# EAGLE design sysXdmd (EAGLE 7.4.0)
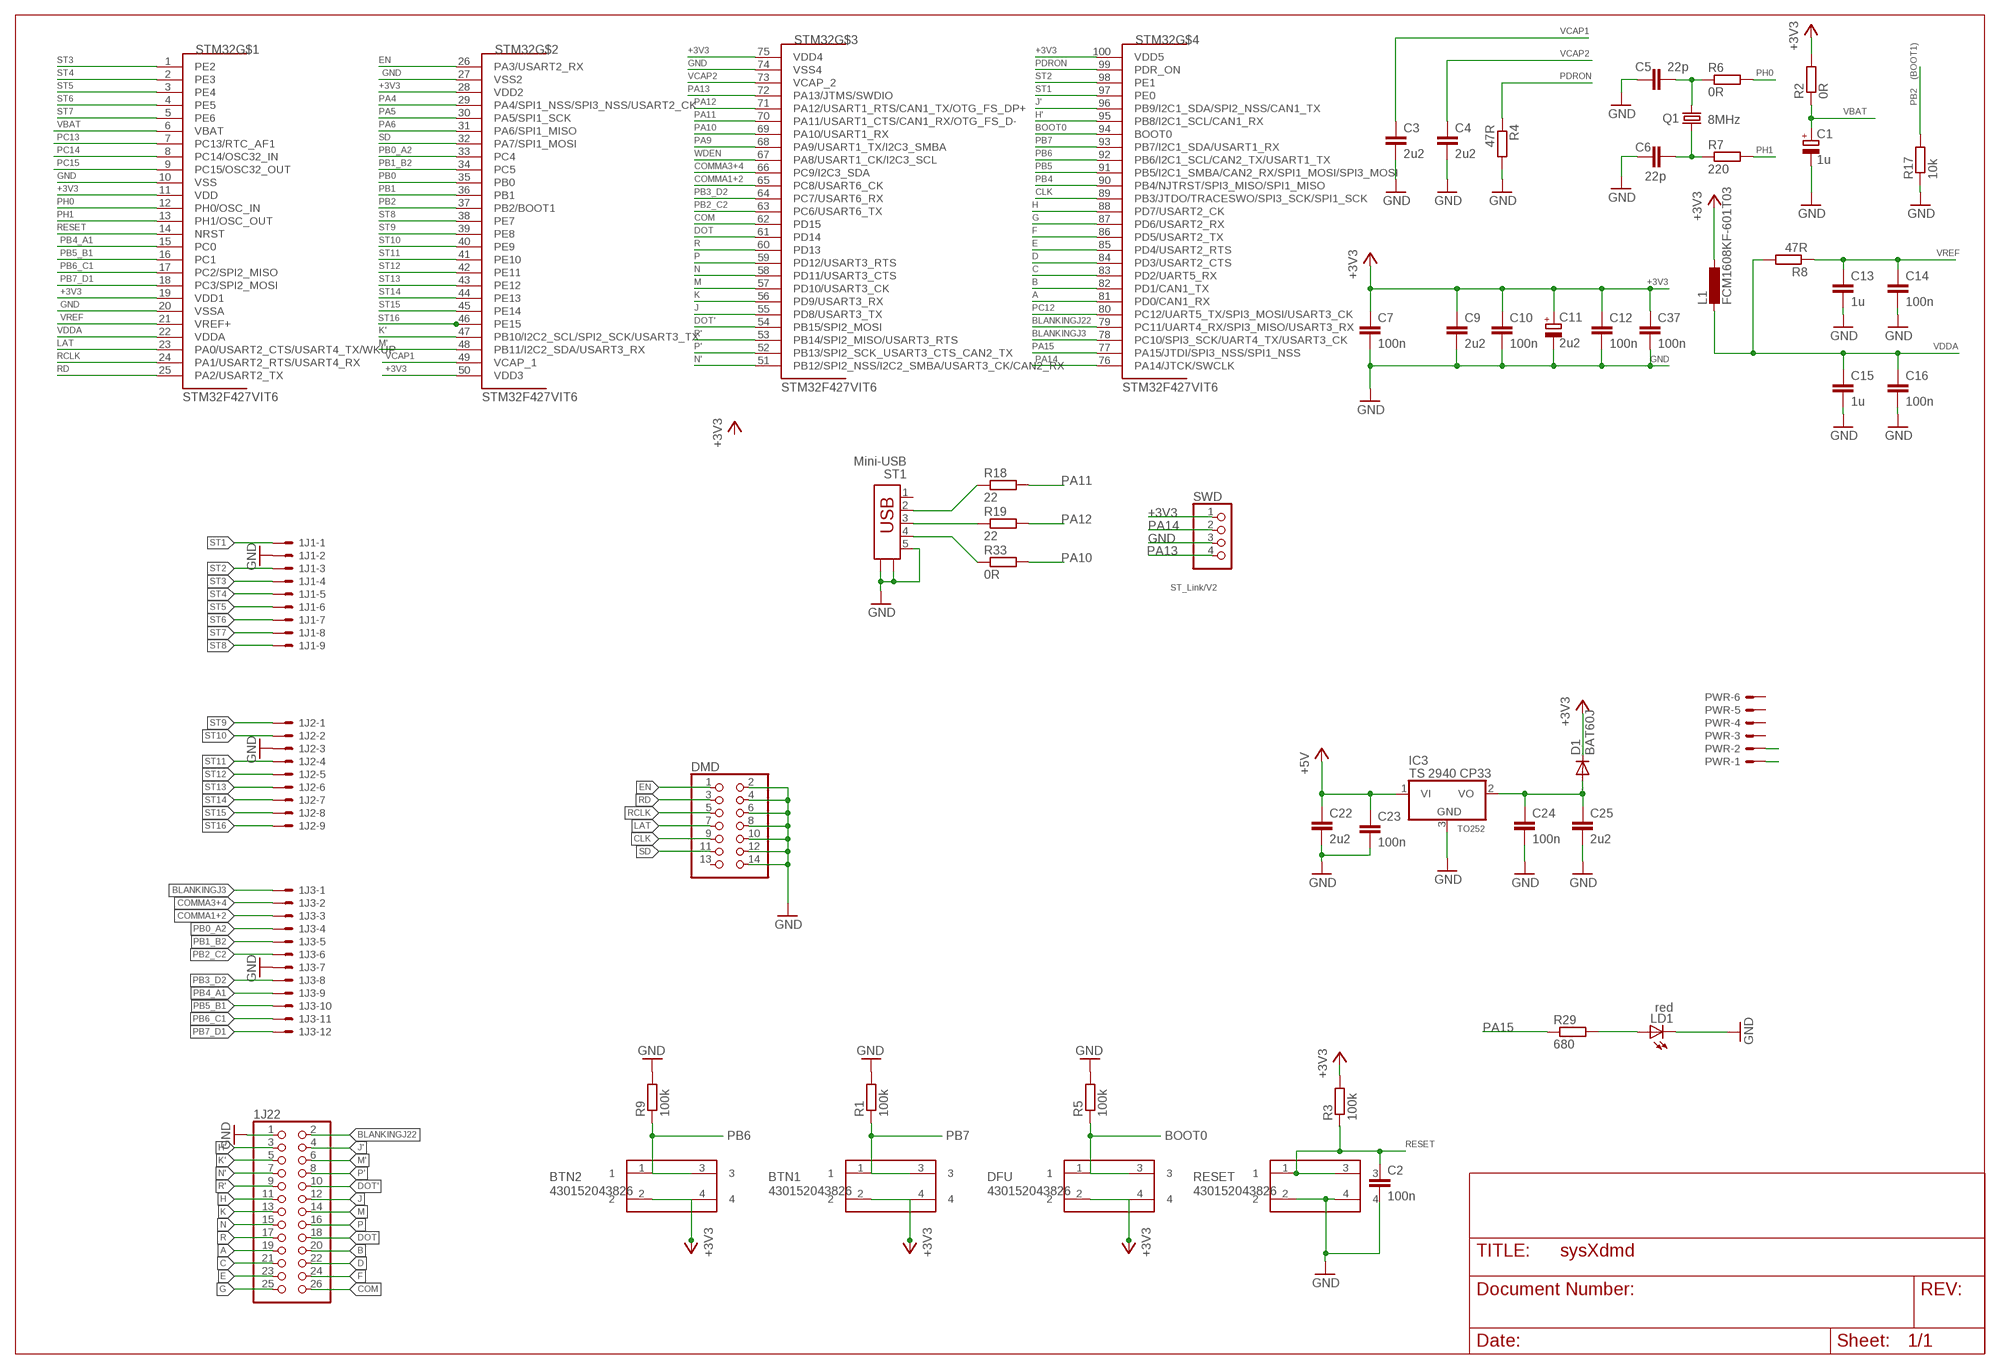
[diagram p0: schematic, sheet 1]

## Parts
1J1  KK-156-9  [KK-156-9]
1J2  KK-156-9  [KK-156-9]
1J3  KK-156-12  [KK-156-12]
1J22  PINHD-2X13  [2X13]
BTN1  430152043826  [430152043826]
BTN2  430152043826  [430152043826]
C1  1u  CPOL-EUCT3528  [CT3528]
C2  100n  C-EUC0805  [C0805]
C3  2u2  C-EUC0805  [C0805]
C4  2u2  C-EUC0805  [C0805]
C5  22p  C-EUC0805  [C0805]
C6  22p  C-EUC0805  [C0805]
C7  100n  C-EUC0805  [C0805]
C9  2u2  C-EUC1206  [C1206]
C10  100n  C-EUC0805  [C0805]
C11  2u2  CPOL-EUCT3528  [CT3528]
C12  100n  C-EUC0805  [C0805]
C13  1u  C-EUC1206  [C1206]
C14  100n  C-EUC0805  [C0805]
C15  1u  C-EUC1206  [C1206]
C16  100n  C-EUC0805  [C0805]
C22  2u2  C-EUC1206  [C1206]
C23  100n  C-EUC0805  [C0805]
C24  100n  C-EUC0805  [C0805]
C25  2u2  C-EUC1206  [C1206]
C37  100n  C-EUC0805  [C0805]
D1  BAT60J  DIODE-SOD323-W  [SOD323-W]
DFU  430152043826  [430152043826]
DMD  PINHD-2X7  [2X07]
IC3  TS 2940 CP33  7808DT  [TO252]
L1  FCM1608KF-601T03  L-EUL0603  [L0603]
LD1  red  LEDCHIP-LED0805  [CHIP-LED0805]
PWR  KK-156-6  [KK-156-6]
Q1  8MHz  CRYSTALHC49UP  [HC49UP]
R1  100k  R-EU_R0805  [R0805]
R2  0R  R-EU_R0805  [R0805]
R3  100k  R-EU_R0805  [R0805]
R4  47R  R-EU_R0805  [R0805]
R5  100k  R-EU_R0805  [R0805]
R6  0R  R-EU_R0805  [R0805]
R7  220  R-EU_R0805  [R0805]
R8  47R  R-EU_R0805  [R0805]
R9  100k  R-EU_R0805  [R0805]
R17  10k  R-EU_R0805  [R0805]
R18  22  R-EU_R0805  [R0805]
R19  22  R-EU_R0805  [R0805]
R29  680  R-EU_R0805  [R0805]
R33  0R  R-EU_R0805  [R0805]
RESET  430152043826  [430152043826]
ST1  Mini-USB  UBS-MINI  [USBMINI]
STM32  STM32F427VIT6  STM32F407VX  [LQFP100]
SWD  PINHD-1X4  [1X04]

## Nets
+3V3: BTN1.2 BTN1.4 BTN2.2 BTN2.4 C7.1 C9.1 C10.1 C11.+ C12.1 C37.1 D1.C DFU.2 DFU.4 L1.1 R2.2 R3.2 STM32.11(VDD) STM32.19(VDD1) STM32.28(VDD2) STM32.50(VDD3) STM32.75(VDD4) STM32.100(VDD5) SWD.1
+5V: C22.1 C23.1 IC3.1(VI) PWR.1
A: 1J22.19 STM32.81(PD0/CAN1_RX)
B: 1J22.20 STM32.82(PD1/CAN1_TX)
BLANKINGJ3: 1J3.1 STM32.78(PC10/SPI3_SCK/UART4_TX/USART3_CK)
BLANKINGJ22: 1J22.2 STM32.79(PC11/UART4_RX/SPI3_MISO/USART3_RX)
BOOT0: DFU.1 DFU.3 R5.1 STM32.94(BOOT0)
C: 1J22.21 STM32.83(PD2/UART5_RX)
CLK: DMD.9 STM32.89(PB3/JTDO/TRACESWO/SPI3_SCK/SPI1_SCK)
COM: 1J22.26 STM32.62(PD15)
COMMA1+2: 1J3.3 STM32.65(PC8/USART6_CK)
COMMA3+4: 1J3.2 STM32.66(PC9/I2C3_SDA)
D: 1J22.22 STM32.84(PD3/USART2_CTS)
DOT: 1J22.18 STM32.61(PD14)
DOT': 1J22.10 STM32.54(PB15/SPI2_MOSI)
E: 1J22.23 STM32.85(PD4/USART2_RTS)
EN: DMD.1 STM32.26(PA3/USART2_RX)
F: 1J22.24 STM32.86(PD5/USART2_TX)
G: 1J22.25 STM32.87(PD6/USART2_RX)
GND: 1J1.2 1J2.3 1J3.7 1J22.1 C1.- C2.2 C3.2 C4.2 C5.2 C6.2 C7.2 C9.2 C10.2 C11.- C12.2 C13.2 C14.2 C15.2 C16.2 C22.2 C23.2 C24.2 C25.2 C37.2 DMD.2 DMD.4 DMD.6 DMD.8 DMD.10 DMD.12 DMD.14 IC3.3(GND) LD1.C PWR.2 R1.2 R4.2 R5.2 R9.2 R17.1 RESET.2 RESET.4 ST1.5 ST1.N1 ST1.N2 STM32.10(VSS) STM32.20(VSSA) STM32.27(VSS2) STM32.74(VSS4) SWD.3
H: 1J22.11 STM32.88(PD7/USART2_CK)
H': 1J22.3 STM32.95(PB8/I2C1_SCL/CAN1_RX)
J: 1J22.12 STM32.55(PD8/USART3_TX)
J': 1J22.4 STM32.96(PB9/I2C1_SDA/SPI2_NSS/CAN1_TX)
K: 1J22.13 STM32.56(PD9/USART3_RX)
K': 1J22.5 STM32.47(PB10/I2C2_SCL/SPI2_SCK/USART3_TX)
LAT: DMD.7 STM32.23(PA0/USART2_CTS/USART4_TX/WKUP)
M: 1J22.14 STM32.57(PD10/USART3_CK)
M': 1J22.6 STM32.48(PB11/I2C2_SDA/USART3_RX)
N: 1J22.15 STM32.58(PD11/USART3_CTS)
N$1: C5.1 Q1.2 R6.1
N$2: C6.1 Q1.1 R7.1
N$12: C24.1 C25.1 D1.A IC3.2(VO)
N$19: LD1.A R29.2
N$25: R33.1 ST1.4
N$39: R19.1 ST1.3
N$40: R18.1 ST1.2
N': 1J22.7 STM32.51(PB12/SPI2_NSS/I2C2_SMBA/USART3_CK/CAN2_RX)
P: 1J22.16 STM32.59(PD12/USART3_RTS)
P': 1J22.8 STM32.52(PB13/SPI2_SCK_USART3_CTS_CAN2_TX)
PA4: STM32.29(PA4/SPI1_NSS/SPI3_NSS/USART2_CK)
PA5: STM32.30(PA5/SPI1_SCK)
PA6: STM32.31(PA6/SPI1_MISO)
PA9: STM32.68(PA9/USART1_TX/I2C3_SMBA)
PA10: R33.2 STM32.69(PA10/USART1_RX)
PA11: R18.2 STM32.70(PA11/USART1_CTS/CAN1_RX/OTG_FS_D-)
PA12: R19.2 STM32.71(PA12/USART1_RTS/CAN1_TX/OTG_FS_DP+)
PA13: STM32.72(PA13/JTMS/SWDIO) SWD.4
PA14: STM32.76(PA14/JTCK/SWCLK) SWD.2
PA15: R29.1 STM32.77(PA15/JTDI/SPI3_NSS/SPI1_NSS)
PB0: STM32.35(PB0)
PB0_A2: 1J3.4 STM32.33(PC4)
PB1: STM32.36(PB1)
PB1_B2: 1J3.5 STM32.34(PC5)
PB2: R17.2 STM32.37(PB2/BOOT1)
PB2_C2: 1J3.6 STM32.63(PC6/USART6_TX)
PB3_D2: 1J3.8 STM32.64(PC7/USART6_RX)
PB4: STM32.90(PB4/NJTRST/SPI3_MISO/SPI1_MISO)
PB4_A1: 1J3.9 STM32.15(PC0)
PB5: STM32.91(PB5/I2C1_SMBA/CAN2_RX/SPI1_MOSI/SPI3_MOSI)
PB5_B1: 1J3.10 STM32.16(PC1)
PB6: BTN2.1 BTN2.3 R9.1 STM32.92(PB6/I2C1_SCL/CAN2_TX/USART1_TX)
PB6_C1: 1J3.11 STM32.17(PC2/SPI2_MISO)
PB7: BTN1.1 BTN1.3 R1.1 STM32.93(PB7/I2C1_SDA/USART1_RX)
PB7_D1: 1J3.12 STM32.18(PC3/SPI2_MOSI)
PC12: STM32.80(PC12/UART5_TX/SPI3_MOSI/USART3_CK)
PC13: STM32.7(PC13/RTC_AF1)
PC14: STM32.8(PC14/OSC32_IN)
PC15: STM32.9(PC15/OSC32_OUT)
PDRON: R4.1 STM32.99(PDR_ON)
PH0: R6.2 STM32.12(PH0/OSC_IN)
PH1: R7.2 STM32.13(PH1/OSC_OUT)
R: 1J22.17 STM32.60(PD13)
R': 1J22.9 STM32.53(PB14/SPI2_MISO/USART3_RTS)
RCLK: DMD.5 STM32.24(PA1/USART2_RTS/USART4_RX)
RD: DMD.3 STM32.25(PA2/USART2_TX)
RESET: C2.1 R3.1 RESET.1 RESET.3 STM32.14(NRST)
SD: DMD.11 STM32.32(PA7/SPI1_MOSI)
ST1: 1J1.1 STM32.97(PE0)
ST2: 1J1.3 STM32.98(PE1)
ST3: 1J1.4 STM32.1(PE2)
ST4: 1J1.5 STM32.2(PE3)
ST5: 1J1.6 STM32.3(PE4)
ST6: 1J1.7 STM32.4(PE5)
ST7: 1J1.8 STM32.5(PE6)
ST8: 1J1.9 STM32.38(PE7)
ST9: 1J2.1 STM32.39(PE8)
ST10: 1J2.2 STM32.40(PE9)
ST11: 1J2.4 STM32.41(PE10)
ST12: 1J2.5 STM32.42(PE11)
ST13: 1J2.6 STM32.43(PE12)
ST14: 1J2.7 STM32.44(PE13)
ST15: 1J2.8 STM32.45(PE14)
ST16: 1J2.9 STM32.46(PE15)
VBAT: C1.+ R2.1 STM32.6(VBAT)
VCAP1: C3.1 STM32.49(VCAP_1)
VCAP2: C4.1 STM32.73(VCAP_2)
VDDA: C15.1 C16.1 L1.2 R8.2 STM32.22(VDDA)
VREF: C13.1 C14.1 R8.1 STM32.21(VREF+)
WDEN: STM32.67(PA8/USART1_CK/I2C3_SCL)
Unconnected: DMD.13 PWR.3 PWR.4 PWR.5 PWR.6 ST1.1

## Notes on the sheet
- (BOOT1)
- ST_Link/V2
- TO252

## Library data of the parts
1J1 1J2 = con-molex:KK-156-9: KK 156 HEADER Source: http://www.molex.com/pdm_docs/sd/026604100_sd.pdf; OC_FARNELL: unknown; OC_NEWARK: unknown
1J3 = con-molex:KK-156-12: KK 156 HEADER Source: http://www.molex.com/pdm_docs/sd/026604100_sd.pdf; OC_FARNELL: unknown; OC_NEWARK: unknown
1J22 = pinhead:PINHD-2X13: PIN HEADER
BTN1 BTN2 DFU RESET = Switches_rev16a:430152043826: WS-TSS-6x6 mm SMD Tact Switch,4 pins
C1 C11 = rcl:CPOL-EU: POLARIZED CAPACITOR, European symbol
C2 C5-C7 C10 C12 C16 C23 C24 C37 = rcl:C-EU: CAPACITOR, European symbol
C3 C4 C9 C13-C15 C22 C25 = resistor:C-EU: CAPACITOR, European symbol
D1 = diode:DIODE-: DIODE
DMD = pinhead:PINHD-2X7: PIN HEADER
IC3 = linear:78*: Positive VOLTAGE REGULATOR Source: http://cache.national.com/ds/LM/LM78L05.pdf http://www.fairchildsemi.com/ds/LM/LM7805.pdf
L1 = rcl:L-EU: INDUCTOR, European symbol
LD1 = adafruit:LED: LED OSRAM: - CHIPLED LG R971, LG N971, LY N971, LG Q971, LY Q971, LO R971, LY R971 LH N974, LH R974 LS Q976, LO Q976, LY Q976 LO Q996 - Hyper CHIPLED LW Q18S LB Q993, LB Q99A, LB R99A - SideLED LS A670, LO A670, LY A670, LG A670, LP A670 LB A673, LV A673, LT A673, LW A673 LH A674 LY A675 LS A676, LA A676, LO A676, LY A676, LW A676 LS A679, LY A679, LG A679 - Hyper Micro SIDELED® LS Y876, LA Y876, LO Y876, LY Y876 LT Y87S - SmartLED LW L88C, LW L88S LB L89C, LB L89S, LG L890 LS L89K, LO L89K, LY L89K LS L896, LA L896, LO L896, LY L896 - TOPLED LS T670, LO T670, LY T670, LG T670, LP T670 LSG T670, LSP T670, LSY T670, LOP T670, LYG T670 LG T671, LOG T671, LSG T671 LB T673, LV T673, LT T673, LW T673 LH T674 LS T676, LA T676, LO T676, LY T676, LB T676, LH T676, LSB T676, LW T676 LB T67C, LV T67C, LT T67C, LS T67K, LO T67K, LY T67K, LW E67C LS E67B, LA E67B, LO E67B, LY E67B, LB E67C, LV E67C, LT E67C LW T67C LS T679, LY T679, LG T679 LS T770, LO T770, LY T770, LG T770, LP T770 LB T773, LV T773, LT T773, LW T773 LH T774 LS E675, LA E675, LY E675, LS T675 LS T776, LA T776, LO T776, LY T776, LB T776 LHGB T686 LT T68C, LB T68C - Hyper Mini TOPLED® LB M676 - Mini TOPLED Santana® LG M470 LS M47K, LO M47K, LY M47K Source: http://www.osram.convergy.de/
PWR = con-molex:KK-156-6: KK 156 HEADER Source: http://www.molex.com/pdm_docs/sd/026604100_sd.pdf; OC_FARNELL: unknown; OC_NEWARK: unknown
Q1 = crystal:CRYSTAL: CRYSTAL; OC_FARNELL: unknown; OC_NEWARK: unknown
R1 R3 R5 R9 R18 R19 R29 R33 = resistor:R-EU_: RESISTOR, European symbol
R2 R4 R6-R8 R17 = rcl:R-EU_: RESISTOR, European symbol
ST1 = con-amp:UBS-MINI
STM32 = STM32F407Vx_LQFP100:STM32F407VX: STmicroelectronics Cortex M4 Series Typ: STM32F407Vx LQFP100 Copyright 2012 by Ersan Günes, Quantitec, info@quantitec.de
SWD = pinhead:PINHD-1X4: PIN HEADER

## Board
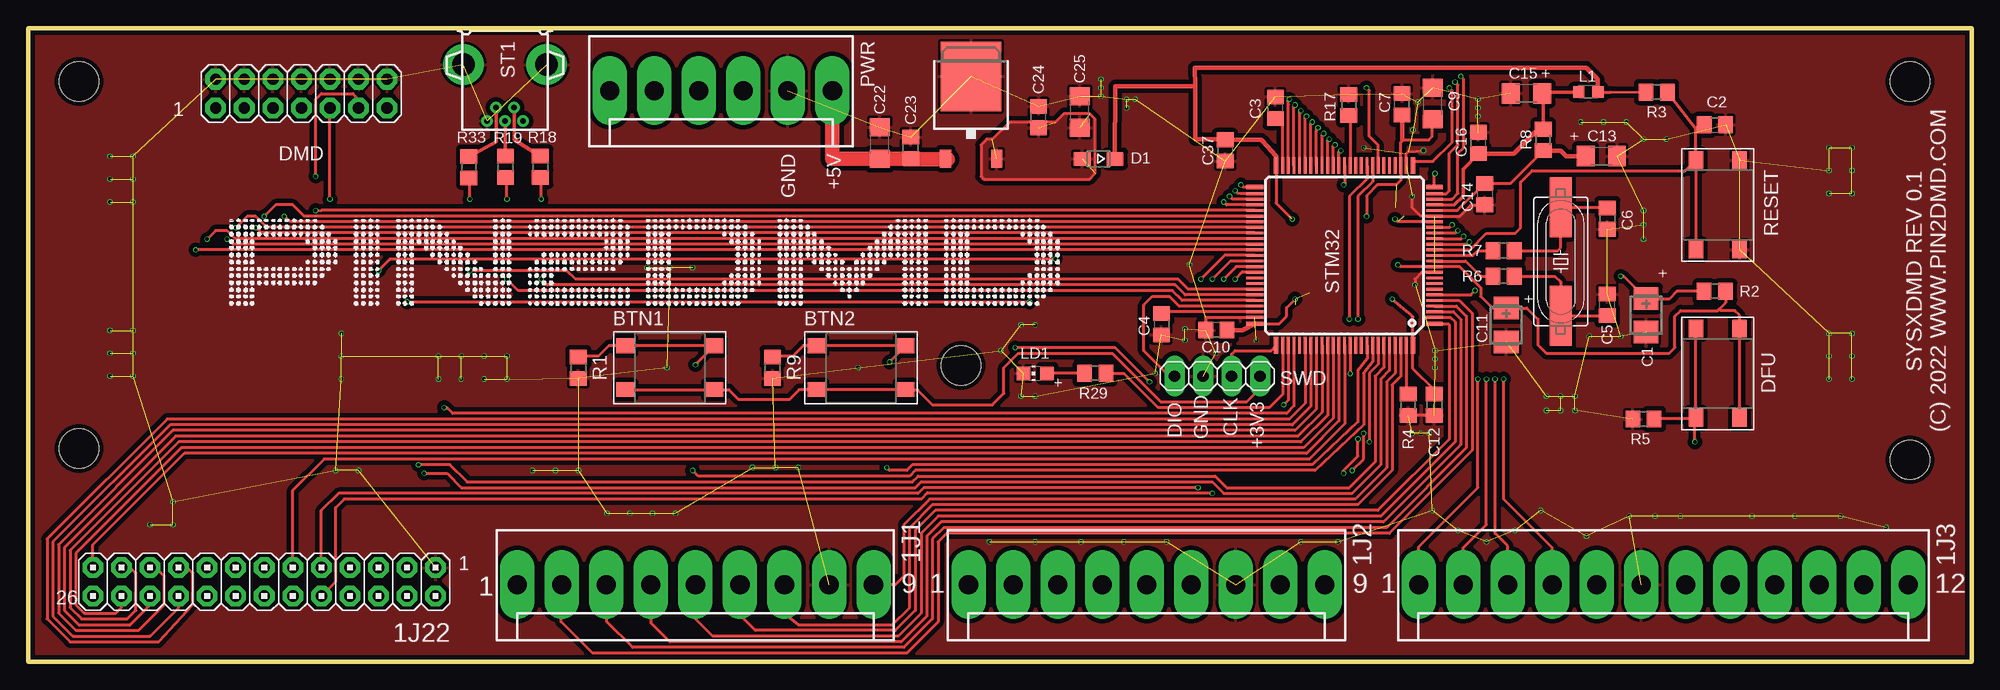
[diagram p1: board, top side]
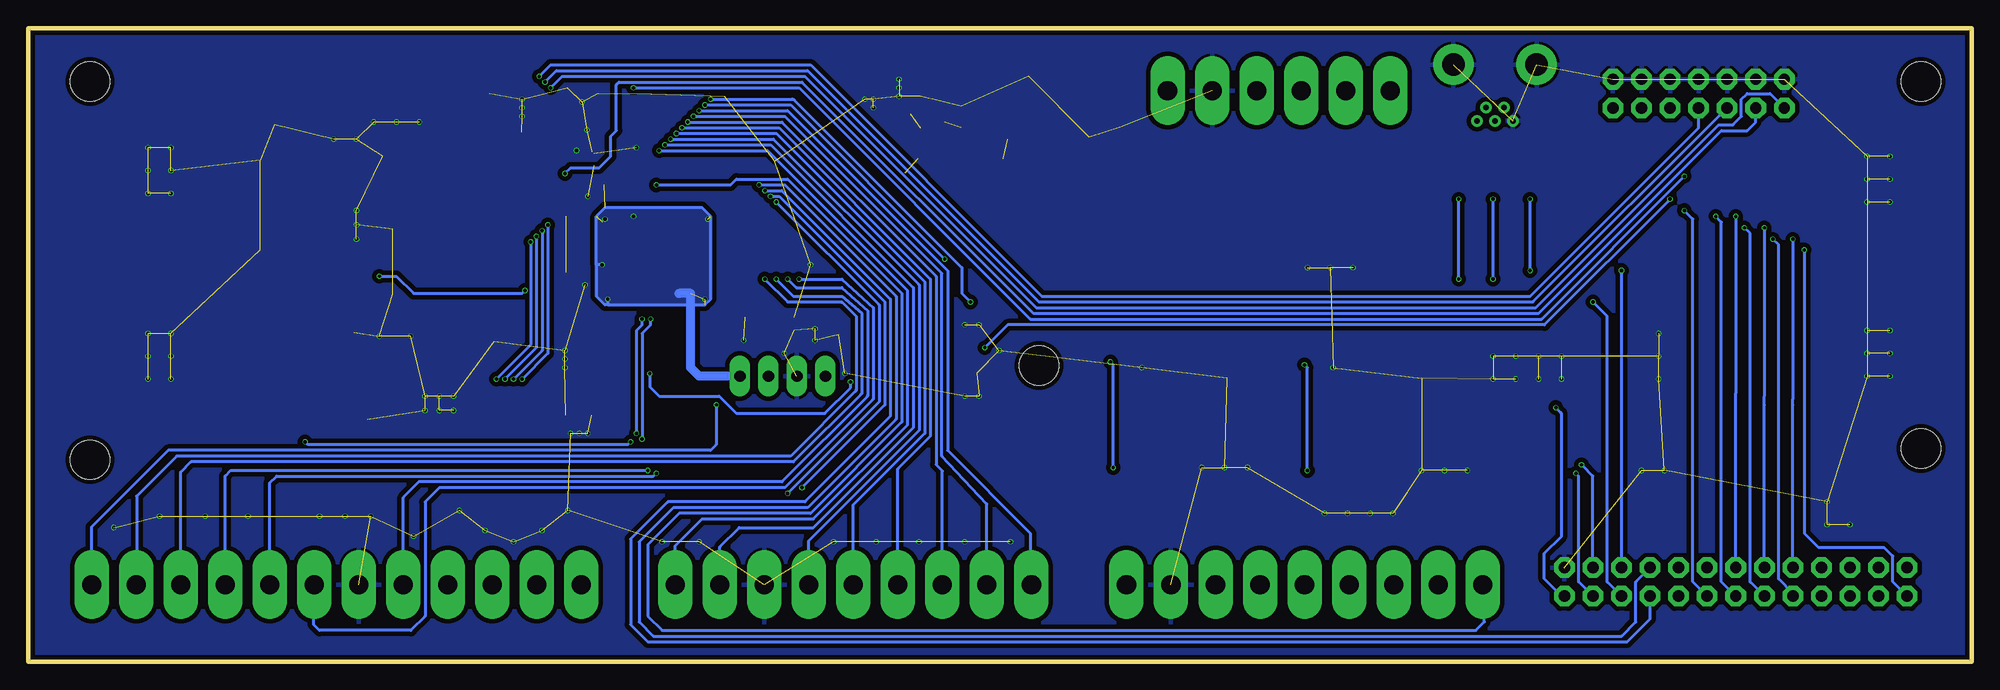
[diagram p2: board, bottom side, seen from below]

Size 172.9 x 56.36 mm. Coordinates in mm from the lower left corner, seen from the top.
Outline: 0,0 0,56.36 172.9,56.36 172.9,0 0,0
Copper layers (1*16): Top 0.035mm / dielectric 1.6mm / Bottom 0.035mm
Design rules "Elecrow_2-layer_PCB_eagle_rule *": minimum track width 5mil, minimum drill 0.3mm, track to track 5mil, track to pad 5mil, pad to pad 5mil, via to via 5mil, smd to smd 0mil, copper to edge 0.2mm, drill to drill 6mil, minimum pad ring 10mil, minimum via ring 3mil, stop-mask expansion 4mil, vias tented up to drill 0mil, thermal gap 10mil
Holes 3.5 mm at 4.51,18.99 167.41,17.97 167.41,51.6 4.51,51.6 82.99,26.35

### Footprints (pad centres in the part's own frame; a part is rotated, then mirrored left to right if it is on the bottom)
KK-156-9 = drill 1.7 pad 2.184 long: 1 -15.84,0; 2 -11.88,0; 3 -7.92,0; 4 -3.96,0; 5 0,0; 6 3.96,0; 7 7.92,0; 8 11.88,0; 9 15.84,0
KK-156-12 = drill 1.7 pad 2.184 long: 1 -21.78,0; 2 -17.82,0; 3 -13.86,0; 4 -9.9,0; 5 -5.94,0; 6 -1.98,0; 7 1.98,0; 8 5.94,0; 9 9.9,0; 10 13.86,0; 11 17.82,0; 12 21.78,0
2X13 = drill 1.016 octagon: 1 -15.24,-1.27; 2 -15.24,1.27; 3 -12.7,-1.27; 4 -12.7,1.27; 5 -10.16,-1.27; 6 -10.16,1.27; 7 -7.62,-1.27; 8 -7.62,1.27; 9 -5.08,-1.27; 10 -5.08,1.27; 11 -2.54,-1.27; 12 -2.54,1.27; 13 0,-1.27; 14 0,1.27; 15 2.54,-1.27; 16 2.54,1.27; 17 5.08,-1.27; 18 5.08,1.27; 19 7.62,-1.27; 20 7.62,1.27; 21 10.16,-1.27; 22 10.16,1.27; 23 12.7,-1.27; 24 12.7,1.27; 25 15.24,-1.27; 26 15.24,1.27
430152043826 = smd 1.55 x 1.3: 1 -3.975,1.95; 2 -3.975,-1.95; 3 3.975,1.95; 4 3.975,-1.95
CT3528 = smd 2 x 2.2: + -1.5,0; - 1.5,0
C0805 = smd 1.3 x 1.5: 1 -0.95,0; 2 0.95,0
C1206 = smd 1.6 x 1.8: 1 -1.4,0; 2 1.4,0
SOD323-W = smd 1.5 x 1.2: A 1.45,0; C -1.45,0
2X07 = drill 1.016 octagon: 1 -7.62,-1.27; 2 -7.62,1.27; 3 -5.08,-1.27; 4 -5.08,1.27; 5 -2.54,-1.27; 6 -2.54,1.27; 7 0,-1.27; 8 0,1.27; 9 2.54,-1.27; 10 2.54,1.27; 11 5.08,-1.27; 12 5.08,1.27; 13 7.62,-1.27; 14 7.62,1.27
TO252 = smd 1 x 1.6: 1 -2.28,-4.8; 2 2.28,-4.8 | smd 5.4 x 6.2: 3 0,2.5
L0603 = smd 1 x 1: 1 -0.85,0; 2 0.85,0
CHIP-LED0805 = smd 1.2 x 1.2: A 0,-1.05; C 0,1.05
KK-156-6 = drill 1.7 pad 2.184 long: 1 -9.9,0; 2 -5.94,0; 3 -1.98,0; 4 1.98,0; 5 5.94,0; 6 9.9,0
HC49UP = smd 5.334 x 1.93: 1 -4.826,0; 2 4.826,0
R0805 = smd 1.3 x 1.5: 1 -0.95,0; 2 0.95,0
USBMINI = drill 0.5: 1 -1.6,3; 2 -0.8,1.8; 3 0,3; 4 0.8,1.8; 5 1.6,3 | drill 2: N1 -3.7,-2; N2 3.7,-2
LQFP100 = smd 1.5 x 0.4: 1 -8,6.075; 25 -8,-6.075; 51 8,-6.075; 75 8,6.075 | smd 1.5 x 0.25: 2 -8,5.5; 3 -8,5; 4 -8,4.5; 5 -8,4; 6 -8,3.5; 7 -8,3; 8 -8,2.5; 9 -8,2; 10 -8,1.5; 11 -8,1; 12 -8,0.5; 13 -8,0; 14 -8,-0.5; 15 -8,-1; 16 -8,-1.5; 17 -8,-2; 18 -8,-2.5; 19 -8,-3; 20 -8,-3.5; 21 -8,-4; 22 -8,-4.5; 23 -8,-5; 24 -8,-5.5; 52 8,-5.5; 53 8,-5; 54 8,-4.5; 55 8,-4; 56 8,-3.5; 57 8,-3; 58 8,-2.5; 59 8,-2; 60 8,-1.5; 61 8,-1; 62 8,-0.5; 63 8,0; 64 8,0.5; 65 8,1; 66 8,1.5; 67 8,2; 68 8,2.5; 69 8,3; 70 8,3.5; 71 8,4; 72 8,4.5; 73 8,5; 74 8,5.5 | smd 0.4 x 1.5: 26 -6.075,-8; 50 6.075,-8; 76 6.075,8; 100 -6.075,8 | smd 0.25 x 1.5: 27 -5.5,-8; 28 -5,-8; 29 -4.5,-8; 30 -4,-8; 31 -3.5,-8; 32 -3,-8; 33 -2.5,-8; 34 -2,-8; 35 -1.5,-8; 36 -1,-8; 37 -0.5,-8; 38 0,-8; 39 0.5,-8; 40 1,-8; 41 1.5,-8; 42 2,-8; 43 2.5,-8; 44 3,-8; 45 3.5,-8; 46 4,-8; 47 4.5,-8; 48 5,-8; 49 5.5,-8; 77 5.5,8; 78 5,8; 79 4.5,8; 80 4,8; 81 3.5,8; 82 3,8; 83 2.5,8; 84 2,8; 85 1.5,8; 86 1,8; 87 0.5,8; 88 0,8; 89 -0.5,8; 90 -1,8; 91 -1.5,8; 92 -2,8; 93 -2.5,8; 94 -3,8; 95 -3.5,8; 96 -4,8; 97 -4.5,8; 98 -5,8; 99 -5.5,8
1X04 = drill 1.016 long: 1 -3.81,0; 2 -1.27,0; 3 1.27,0; 4 3.81,0

### Placement (x,y rotation side)
1J1  59.36,6.86 180 top
1J2  99.49,6.86 180 top
1J3  145.47,6.86 180 top
1J22  21.01,7.11 180 top
BTN1  57.07,26.16 0 top
BTN2  74.09,26.16 0 top
C1  143.91,30.82 270 top
C2  150.04,47.75 0 top
C3  110.95,49.29 90 top
C4  100.81,30.02 270 top
C5  140.46,31.75 90 top
C6  140.48,39.42 270 top
C7  122.21,49.58 90 top
C9  124.95,49.64 90 top
C10  105.7,29.51 180 top
C11  131.49,29.96 270 top
C12  125.07,22.86 270 top
C13  139.93,44.98 0 top
C14  129.56,41.61 270 top
C15  133.28,50.56 180 top
C16  129.01,46.15 90 top
C22  75.76,46.13 90 top
C23  78.51,45.71 90 top
C24  89.88,48.45 90 top
C25  93.54,48.89 90 top
C37  106.47,45.48 270 top
D1  95.22,44.74 180 top
DFU  150.29,25.65 90 top
DMD  24.31,50.55 0 top
IC3  83.88,49.56 0 top
L1  138.79,50.67 180 top
LD1  89.59,25.65 90 top
PWR  61.65,50.8 180 top
Q1  136.32,35.61 270 top
R1  48.95,26.16 270 top
R2  150.04,32.95 0 top
R3  144.86,50.67 180 top
R4  122.76,22.86 270 top
R5  143.69,21.59 180 top
R6  131.24,34.29 180 top
R7  131.24,36.58 180 top
R8  134.77,46.42 90 top
R9  66.22,26.16 270 top
R17  117.47,49.52 270 top
R18  45.57,44.03 270 top
R19  42.46,44.03 270 top
R29  94.92,25.65 180 top
R33  39.2,43.99 270 top
RESET  150.29,40.64 90 top
ST1  42.42,51.11 180 top
STM32  117.09,36.14 180 top
SWD  105.78,25.4 180 top

### Tracks (layer width: path | path; a pad name or v marks a point on that pad's centre or on a via)
+3V3  (via drill 0.3)  (5 unrouted)
  Top 0.254: 111.01,44.96 111.07,44.92 STM32.50 111.02,40.8 v112.45,39.37 | 122.25,46.43 122.35,46.43 | 122.35,46.43 124.59,46.43 124.89,46.74 124.89,48.18 C9.1 | C12.1 125.07,24.21 123.17,26.08 STM32.100 123.17,30.68 122.86,30.99 v121.34,32.26 | STM32.19 121.82,39.14 v121.59,39.37 | v119.05,39.62 119.05,41.45 120.02,42.42 121.69,42.42 122.09,42.82 STM32.28 122.09,46.17 122.35,46.43 | STM32.75 111.27,30.06 111.94,30.73 111.94,31.5 v112.7,32.26 | v121.84,35.31 122.01,35.14 STM32.11 127.34,35.14 129.21,33.27 129.21,32.51 130.23,31.5 131.45,31.5 C11.+ 133.31,31.46 134.29,30.48 134.29,28.19 135.05,27.43 145.97,27.43 146.48,27.94 146.48,30.73 146.99,31.24 150.29,31.24 150.42,31.37 | L1.1 140.77,50.67 143.89,50.7 R3.2 | DFU.2 DFU.4 152.24,30.82 151.82,31.24 150.55,31.24 150.42,31.37 | 150.42,31.37 150.99,31.94 R2.2 | BTN1.2 BTN1.4 | BTN1.4 61.31,24.21 61.65,23.88 | BTN1.4 62.33,24.21 63.17,23.37 67.74,23.37 68.59,24.21 BTN2.2 BTN2.4 79.09,24.21 80.44,22.86 85.78,22.86 86.79,23.88 86.79,26.16 88.06,27.43 96.44,27.43 100.76,23.11 108.38,23.11 109.65,24.38 109.65,25.34 SWD.1
  Top 0.305: 122.25,48.59 C7.1
  Top 0.406: C10.1 107.98,29.51 STM32.75 | 111.01,44.96 109.77,46.34 109.67,46.43 C37.1 106.42,46.48 103.81,46.48 103.81,51.18 | 122.25,46.43 122.25,48.59 | D1.C 96.7,51.18 103.81,51.18 | L1.1 139.64,51.8 138.61,52.83 103.76,52.83 103.81,51.18
  Bottom 0.254: 122.35,35.31 122.35,39.62 121.59,40.39 112.95,40.39 112.19,39.62 112.19,32.26 112.7,31.75 121.34,31.75 | 122.35,35.31 122.35,32.51 121.59,31.75 121.34,31.75 | v121.34,32.26 121.34,31.75 | v121.84,35.31 122.35,35.31
  Bottom 0.813: SWD.1 113.21,25.4 113.97,26.16 113.97,32.77 114.99,32.77
  pour Bottom: 112.19,32.26 112.7,31.75 121.59,31.75 122.35,32.51 122.35,39.62 121.59,40.39 112.95,40.39 112.19,39.62
+5V
  Top 1.27: IC3.1 81.79,44.7 78,44.7 C23.1 75.25,44.76 C22.1 71.55,44.73 PWR.1
A
  Top 0.254: STM32.81 113.59,22.99 112.19,21.59 12.37,21.59 1.7,10.92 1.7,3.81 3.73,1.78 11.61,1.78 14.66,5.08 14.66,7.87 14.15,8.38 1J22.19
B
  Top 0.254: STM32.82 114.09,22.73 112.45,21.08 12.62,21.08 2.21,10.67 2.21,4.06 3.99,2.29 10.85,2.29 13.39,4.83 1J22.20
BLANKINGJ3  (via drill 0.3)
  Top 0.254: STM32.78 112.09,23.27 v111.68,22.86
  Bottom 0.254: v111.68,22.86 111.68,19.41 arc45 111.76,19.23 112.19,18.8 160.45,18.8 167.25,12 1J3.1
BLANKINGJ22  (via drill 0.3)
  Top 0.254: STM32.79 112.59,22.75 111.94,22.1 37.77,22.1 37.34,22.53 arc45 37.16,22.61 v37.01,22.61
  Bottom 0.254: 1J22.2 36.5,5.84 38.02,7.37 38.02,9.65 36.5,11.18 36.5,21.99 arc-45 36.57,22.17 v37.01,22.61
BOOT0  (via drill 0.3)
  Top 0.254: DFU.3 DFU.1 148.26,21.6 | STM32.94 120.09,26.44 119.3,25.65 v119.3,19.56 | v148.26,19.56 148.26,21.6 | 148.26,21.6 R5.1
  Bottom 0.254: v119.3,19.56 119.56,19.3 148.01,19.3 v148.26,19.56
C
  Top 0.254: STM32.83 114.59,22.47 112.7,20.57 12.88,20.57 2.72,10.41 2.72,4.32 4.24,2.79 9.83,2.79 12.12,5.08 12.12,7.62 11.35,8.38 1J22.21
CLK  (via drill 0.3)
  Top 0.254: v26.85,41.15 DMD.9 | STM32.89 v117.6,25.63 | v99.75,24.89 96.7,27.94 v87.81,27.94
  Bottom 0.254: v117.6,25.63 117.6,24.46 116.76,23.62 111.43,23.62 109.91,22.1 102.03,22.1 99.75,24.38 v99.75,24.89 | v26.85,41.15 38.02,29.97 85.78,29.97 v87.81,27.94
COM  (via drill 0.3)
  Top 0.254: STM32.62 v14.91,36.64
  Bottom 0.254: 1J22.26 7.04,7.11 7.04,9.4 7.8,10.16 13.64,10.16 14.91,11.43 v14.91,36.64
COMMA1+2  (via drill 0.3)
  Top 0.254: STM32.65 107.46,35.14 v106.35,34.04
  Bottom 0.254: v106.35,34.04 104.83,32.51 100.51,32.51 98.73,30.99 98.73,23.98 arc45 98.8,23.8 104.83,17.78 158.42,17.78 159.33,16.87 1J3.3
COMMA3+4  (via drill 0.3)
  Top 0.254: STM32.66 107.97,34.64 v107.37,34.04
  Bottom 0.254: v107.37,34.04 105.33,32 100.61,32 arc45 100.43,31.93 99.24,30.73 99.24,24.23 arc45 99.31,24.06 105.08,18.29 159.69,18.29 163.25,14.73 163.25,6.9 1J3.2
D
  Top 0.254: STM32.84 115.09,22.21 112.95,20.07 13.13,20.07 3.23,10.16 3.23,4.57 4.5,3.3 9.07,3.3 10.85,5.08 1J22.22
DOT  (via drill 0.3)
  Top 0.254: STM32.61 18.21,37.14 17.76,37.59 v17.7,37.59
  Bottom 0.254: 1J22.18 15.93,6.1 17.2,7.37 17.2,37.08 v17.7,37.59
DOT'  (via drill 0.3)
  Top 0.254: v105.33,14.99 79.93,14.99 79.43,14.48 28.12,14.48 27.36,13.72 27.36,7.11 1J22.10 | STM32.54 108.13,40.64 106.6,40.64 v106.35,40.89
  Bottom 0.254: v106.35,40.89 97.21,31.75 97.21,23.11 v105.33,14.99
E
  Top 0.254: STM32.85 115.59,21.94 113.21,19.56 13.39,19.56 3.73,9.91 3.73,4.83 4.75,3.81 8.81,3.81 9.58,4.57 9.58,7.87 9.07,8.38 1J22.23
EN  (via drill 0.3)
  Top 0.254: STM32.26 123.17,44.5 124.95,44.5 126.67,46.23 126.67,50.8 v126.42,51.05
  Bottom 0.254: v126.42,51.05 125.4,52.07 103.81,52.07 83.24,31.5 38.79,31.5 22.53,47.75 21.26,47.75 20.5,48.51 20.5,50.04 19.99,50.55 17.96,50.55 DMD.1
F
  Top 0.254: STM32.86 116.09,21.68 113.46,19.05 13.64,19.05 4.24,9.65 4.24,5.08 5,4.32 7.8,4.32 8.31,4.83 1J22.24
G
  Top 0.254: STM32.87 116.59,21.42 113.72,18.54 13.89,18.54 5.77,10.41 1J22.25
GND  (via drill 0.3, 0.32)  (165 unrouted)
  Top 0.254: STM32.74 104.75,30.64 C10.2 | C14.2 129.52,40.62 128.3,40.62 127.32,39.64 STM32.20 123.86,39.64 123.11,40.39 v123.11,41.4 | C12.2 R4.2 | v124.13,45.47 122.75,45.35 122.59,45.2 STM32.27 | STM32.10 123.97,34.64 123.37,34.04 v123.37,33.53
  other vias: 125.15,27.69 143.69,37.59 143.69,38.86 143.69,40.13 138.1,48.01 140.13,48.01 142.16,48.01 143.69,46.48 145.72,46.48 141.66,28.96 138.86,28.96 97.71,49.28 97.71,50.04 98.48,50.04 95.43,50.29 95.43,51.05 95.43,51.82 123.11,20.32 123.88,20.32 124.64,20.32 125.15,26.92 125.15,26.16 123.62,49.78 123.19,47.29 128.96,48.51 128.96,49.28 128.96,50.04 12.88,14.22 10.85,12.19 12.88,12.19 27.36,17.02 29.39,17.02 27.86,25.15 27.86,27.18 27.86,29.21 36.5,27.18 38.53,27.18 40.56,27.18 42.6,27.18 51.49,13.21 53.52,13.21 55.55,13.21 57.58,13.21 7.29,40.89 7.29,42.93 7.29,44.96 9.32,44.96 9.32,42.93 9.32,40.89 88.32,29.97 89.59,29.97 124.89,13.46 127.18,11.68 134.54,13.46 132.26,11.68 160.2,25.15 160.2,27.18 160.2,29.21 162.23,29.21 162.23,27.18 162.23,25.15 160.2,41.66 160.2,43.69 160.2,45.72 162.23,45.72 162.23,43.69 162.23,41.66 142.42,12.95 144.7,12.95 146.99,12.95 153.34,12.95 157.15,12.95 161.21,12.95 165.28,11.94 89.59,10.67 93.65,10.67 97.46,10.67 101.27,10.67 85.52,10.67 55.04,35.05 57.07,35.05 59.11,35.05 105.64,27.43 102.9,29.62 102.9,28.6 109.25,28.6 36.5,25.15 38.53,25.15 40.56,25.15 42.6,25.15 113.21,10.67 116.51,10.67 138.61,11.18 129.72,10.67 118.8,45.72 88.32,23.62 89.59,23.62 7.29,29.46 7.29,27.43 7.29,25.4 9.32,25.4 9.32,27.43 9.32,29.46 44.88,17.02 46.91,17.02 48.95,17.02 64.44,17.27 66.47,17.27 68.5,17.27 73.84,26.16 56.82,26.16 86.54,27.69 103.3,35.31 100.25,25.65 135.05,23.62 136.32,23.62 137.59,23.62 137.59,22.35 136.32,22.35 135.05,22.35
  pour Bottom (isolate 0.406): -0.25,0 0,56.62 172.9,56.36 172.9,-0.25
  pour Top (isolate 0.406): 172.9,56.36 172.9,-0.25 0,0 0,56.62
H
  Top 0.254: STM32.88 117.09,21.16 113.97,18.03 26.34,18.03 23.55,15.24 1J22.11
H'  (via drill 0.3)
  Top 0.254: STM32.95 120.59,26.18 119.81,25.4 119.81,17.78 117.53,15.49 106.6,15.49 105.59,16.51 79.17,16.51 78.66,16 39.04,16 37.52,17.53 v34.72,17.53
  Bottom 0.254: 1J22.3 33.71,16.51 v34.72,17.53
J  (via drill 0.3)
  Top 0.254: STM32.55 26.08,40.14 v25.58,40.13
  Bottom 0.254: 1J22.12 24.82,7.11 24.82,39.37 v25.58,40.13
J'  (via drill 0.3)
  Top 0.254: STM32.96 121.09,25.92 120.32,25.15 120.32,17.53 117.78,14.99 106.35,14.99 105.33,16 79.43,16 78.92,15.49 38.53,15.49 37.26,16.76 v35.23,16.76
  Bottom 0.254: 1J22.4 34.98,7.11 34.98,16.51 v35.23,16.76
K  (via drill 0.3)
  Top 0.254: STM32.56 24.54,39.64 23.55,40.64 22.02,40.64 v21.01,39.62
  Bottom 0.254: 1J22.13 21.01,23.37 21.01,23.88 v21.01,39.62
K'  (via drill 0.3)
  Top 0.254: STM32.47 112.59,49.42 v112.7,49.53 | v91.36,35.81 32.29,35.81 arc45 32.11,35.74 v31.17,34.8
  Bottom 0.254: 1J22.5 v31.17,34.8 | v112.7,49.53 105.08,49.53 v91.36,35.81
LAT  (via drill 0.3)
  Top 0.254: STM32.23 126.66,41.14 127.18,41.66 127.18,45.21 127.69,45.72 127.69,51.82 v127.43,52.07
  Bottom 0.254: v127.43,52.07 126.42,53.09 103.3,53.09 82.73,32.51 39.29,32.51 24.31,47.5 DMD.7
M  (via drill 0.3)
  Top 0.254: STM32.57 23.32,39.14 22.84,39.62 v22.78,39.62
  Bottom 0.254: 1J22.14 22.28,7.11 22.28,39.12 v22.78,39.62
M'  (via drill 0.3)
  Top 0.254: STM32.48 112.09,49.58 arc-45 112.17,50.01 v112.19,50.04 | v33.71,32 v89.08,32
  Bottom 0.254: v112.19,50.04 104.93,50.04 arc45 104.75,49.96 89.84,35.05 89.84,32.77 v89.08,32 | 1J22.6 32.44,7.11 32.44,30.73 v33.71,32
N  (via drill 0.3)
  Top 0.254: STM32.58 21.23,38.64 20.24,39.62 19.48,39.62 v18.47,38.61
  Bottom 0.254: 1J22.15 18.47,22.86 18.47,23.62 v18.47,38.61
N$1
  Top 0.254: C5.1 140.45,30.78 Q1.2 136.32,33.78 135.81,34.29 R6.1
N$2
  Top 0.254: C6.1 140.41,40.43 Q1.1 136.32,36.83 136.07,36.58 R7.1
N$12  (4 unrouted)
  Top 0.254: 94.92,43.43 94.92,48.26 94.41,48.77 92.13,48.77 91.36,48.01 87.3,48.01 85.78,46.48 85.27,46.48 84.76,45.97 84.76,43.18 85.01,42.93 94.41,42.93 94.92,43.43
  pour Top (isolate 0.813): 94.92,48.26 94.41,48.77 92.13,48.77 91.36,48.01 87.3,48.01 85.78,46.48 85.27,46.48 84.76,45.97 84.76,43.18 85.01,42.93 94.41,42.93 94.92,43.43
N$19
  Top 0.254: R29.2 LD1.A
N$25
  Top 0.305: ST1.4 41.62,46.27 R33.1
N$39
  Top 0.305: ST1.3 42.42,45.35 R19.1
N$40
  Top 0.305: ST1.2 43.22,46.45 R18.1
N'  (via drill 0.3)
  Top 0.254: STM32.51 108.07,42.22 v107.87,42.42
  Bottom 0.254: v107.87,42.42 105.59,42.42 95.68,32.51 95.68,21.59 103.56,13.72 115.49,13.72 118.54,10.67 118.54,3.56 117.27,2.29 31.17,2.29 29.9,3.56 29.9,7.11 1J22.7
P  (via drill 0.3)
  Top 0.254: STM32.59 20.75,38.14 20.29,38.61 v20.24,38.61
  Bottom 0.254: 1J22.16 19.74,7.11 19.74,38.1 v20.24,38.61
P'  (via drill 0.3)
  Top 0.254: STM32.52 107.86,41.64 107.61,41.67 v107.37,41.91
  Bottom 0.254: v107.37,41.91 105.84,41.91 96.19,32.26 96.19,21.84 103.81,14.22 116,14.22 119.3,10.92 119.3,3.3 117.78,1.78 30.66,1.78 28.63,3.81 1J22.8
PA10  (via drill 0.3)
  Top 0.254: STM32.69 103.18,33.14 102.29,34.04 48.69,34.04 47.93,34.8 v39.29,34.8 | v39.29,41.15 39.29,42.95 R33.2
  Bottom 0.254: v39.29,34.8 v39.29,41.15
PA11  (via drill 0.3)
  Top 0.254: STM32.70 102.92,32.64 102.03,33.53 46.15,33.53 v45.64,34.04 | v45.64,41.15 45.64,43 R18.2
  Bottom 0.254: v45.64,34.04 v45.64,41.15
PA12  (via drill 0.3)
  Top 0.254: STM32.71 102.66,32.14 101.78,33.02 43.61,33.02 v42.6,34.04 | v42.6,41.15 42.6,42.95 R19.2
  Bottom 0.254: v42.6,34.04 v42.6,41.15
PA13
  Top 0.254: SWD.4 101.52,25.4 99.24,27.69 99.24,31.75 100,32.51 101.52,32.51 102.39,31.64 STM32.72
PA14
  Top 0.254: SWD.2 107.05,27.37 107.37,27.69 110.56,27.69 STM32.76
PA15
  Top 0.254: STM32.77 111.59,23.79 110.41,22.61 100.51,22.61 97.46,25.65 R29.1
PB0_A2  (via drill 0.3)
  Top 0.254: STM32.33 119.59,42.71 118.29,41.4 v118.29,30.48 | v117.78,17.02 118.8,18.03 v118.8,20.32
  Bottom 0.254: 1J3.4 155.37,16.52 154.86,17.02 v117.78,17.02 | v118.8,20.32 118.8,29.46 118.29,29.97 v118.29,30.48
PB1_B2  (via drill 0.3)
  Top 0.254: STM32.34 119.09,42.97 117.53,41.4 v117.53,30.48 | v117.02,16.76 117.02,17.02 118.29,18.29 v118.29,19.81
  Bottom 0.254: 1J3.5 151.41,15.9 150.8,16.51 117.27,16.51 v117.02,16.76 | v118.29,19.81 118.29,29.21 117.53,29.97 v117.53,30.48
PB2
  Top 0.254: R17.2 117.59,48.57 STM32.37
PB2_C2  (via drill 0.3)
  Top 0.254: STM32.63 106.42,36.14 v104.32,34.04
  Bottom 0.254: v104.32,34.04 100.51,34.04 97.71,31.5 97.71,23.47 arc45 97.79,23.29 105.59,15.49 136.32,15.49 137.59,14.22 137.59,4.06 138.86,2.79 146.99,2.79 147.5,3.3 147.5,6.81 1J3.6
PB3_D2  (via drill 0.3)
  Top 0.254: STM32.64 106.94,35.64 v105.33,34.04
  Bottom 0.254: 1J3.8 139.53,14.63 138.16,16 105.84,16 98.3,23.55 arc-45 98.22,23.73 98.22,31.24 100.51,33.27 104.57,33.27 v105.33,34.04
PB4_A1  (via drill 0.3)
  Top 0.254: 1J3.9 135.57,10.15 131.24,14.48 v131.24,25.15 | STM32.15 128,37.14 v128.19,37.34
  Bottom 0.254: v128.19,37.34 128.19,28.19 v131.24,25.15
PB5_B1  (via drill 0.3)
  Top 0.254: 1J3.10 131.61,10.3 130.48,11.43 v130.48,25.15 | STM32.16 127.48,37.64 v127.69,37.85
  Bottom 0.254: v127.69,37.85 127.69,27.94 v130.48,25.15
PB6  (via drill 0.3)
  Top 0.254: STM32.92 119.09,26.97 118.29,25.91 118.29,21.34 114.22,17.53 78.66,17.53 78.16,17.02 76.63,17.02 v76.38,17.27 | v76.63,26.67 76.63,26.68 BTN2.3 BTN2.1 68.93,28.11 68,27.18 66.28,27.18 R9.1
  Bottom 0.254: v76.38,17.27 76.38,26.42 v76.63,26.67
PB6_C1  (via drill 0.3)
  Top 0.254: STM32.17 126.97,38.14 v127.18,38.35 | 1J3.11 127.65,10.12 129.72,12.19 v129.72,25.15
  Bottom 0.254: v127.18,38.35 127.18,27.69 v129.72,25.15
PB7  (via drill 0.3)
  Top 0.254: STM32.93 119.59,26.71 118.8,25.65 118.8,21.08 114.48,17.02 78.92,17.02 78.41,16.51 59.61,16.51 v59.11,17.02 | v59.36,26.42 BTN1.3 BTN1.1 51.66,28.11 50.72,27.18 49.01,27.18 R1.1
  Bottom 0.254: v59.11,17.02 59.11,26.16 v59.36,26.42
PB7_D1  (via drill 0.3)
  Top 0.254: STM32.18 126.45,38.64 v126.67,38.86 | 1J3.12 123.69,10.22 128.96,15.49 v128.96,25.15
  Bottom 0.254: v126.67,38.86 126.67,27.43 v128.96,25.15
PDRON
  Top 0.254: 122.62,23.81 R4.1 122.59,23.98 STM32.99
PH0
  Top 0.254: STM32.12 127.86,35.64 129.21,34.29 R6.2
PH1
  Top 0.254: STM32.13 128.52,36.14 128.96,36.58 R7.2
R  (via drill 0.3)
  Top 0.254: STM32.60 18.42,37.64 17.7,38.35 16.69,38.35 v15.93,37.59
  Bottom 0.254: 1J22.17 15.93,22.86 15.93,23.37 v15.93,37.59
R'  (via drill 0.3)
  Top 0.254: v104.06,15.49 79.68,15.49 79.17,14.99 27.61,14.99 26.09,13.46 1J22.9 | STM32.53 108.13,41.14 108.13,41.15 107.11,41.15 v106.86,41.4
  Bottom 0.254: v106.86,41.4 106.1,41.4 96.7,32 96.7,22.86 v104.06,15.49
RCLK  (via drill 0.3)
  Top 0.254: STM32.24 126.15,41.64 126.42,41.91 126.42,45.21 127.18,45.97 127.18,51.31 v126.92,51.56
  Bottom 0.254: v126.92,51.56 125.91,52.58 103.56,52.58 82.98,32 39.04,32 DMD.5
RD  (via drill 0.3)
  Top 0.254: STM32.25 125.09,43.38 v125.15,43.43
  Bottom 0.254: v125.15,43.43 124.64,43.94 122.1,43.94 121.08,44.96 121.08,46.74 120.57,47.24 120.57,51.31 120.32,51.56 104.06,51.56 83.49,30.99 38.53,30.99 22.28,47.24 19.99,47.24 19.23,48.01 DMD.3
RESET
  Top 0.254: STM32.14 128.26,36.64 129.72,38.1 132.26,38.1 132.77,38.61 132.77,42.67 133.78,43.69 147.42,43.69 RESET.3 | RESET.3 RESET.1 | RESET.3 148.34,47.42 | 148.34,47.42 148.26,47.5 R3.1 | C2.1 148.42,47.5 148.34,47.42
SD  (via drill 0.3)
  Top 0.254: v119.05,51.05 119.3,50.8 119.3,46.74 120.09,45.95 STM32.32 | v25.58,43.18 25.58,50.04 26.09,50.55 28.88,50.55 29.39,50.04 DMD.11
  Bottom 0.254: v119.05,51.05 104.32,51.05 83.74,30.48 38.28,30.48 v25.58,43.18
ST1
  Top 0.254: STM32.97 121.59,25.66 120.83,24.89 120.83,17.27 118.03,14.48 80.19,14.48 77.9,12.19 77.9,7.62 77.14,6.86 1J1.1
ST2
  Top 0.254: STM32.98 122.1,25.4 121.34,24.64 121.34,17.02 118.29,13.97 80.44,13.97 78.41,11.94 78.41,4.83 76.89,3.3 68.5,3.3 67.28,4.27 1J1.3
ST3
  Top 0.254: STM32.1 126.32,30.07 126.42,29.97 126.42,19.81 120.07,13.46 80.7,13.46 78.92,11.68 78.92,4.57 77.14,2.79 64.69,2.79 63.32,4.17 1J1.4
ST4
  Top 0.254: STM32.2 126.51,30.64 126.92,30.23 126.92,19.56 120.32,12.95 80.95,12.95 79.43,11.43 79.43,4.32 77.39,2.29 60.88,2.29 59.36,3.81 1J1.5
ST5
  Top 0.254: STM32.3 126.77,31.14 127.43,30.48 127.43,19.3 120.57,12.45 81.2,12.45 79.93,11.18 79.93,4.06 77.65,1.78 57.07,1.78 55.4,3.45 1J1.6
ST6
  Top 0.254: STM32.4 127.03,31.64 127.94,30.73 127.94,19.05 120.83,11.94 81.46,11.94 80.44,10.92 80.44,3.81 77.9,1.27 53.77,1.27 51.44,3.6 1J1.7
ST7
  Top 0.254: STM32.5 127.29,32.14 128.45,30.99 128.45,18.8 121.08,11.43 81.71,11.43 80.95,10.67 80.95,3.56 78.16,0.76 50.22,0.76 47.42,3.56 47.42,6.8 1J1.8
ST8  (via drill 0.3)
  Top 0.254: STM32.38 117.09,42.49 v117.02,42.42
  Bottom 0.254: v117.02,42.42 110.41,42.42 109.91,42.93 105.33,42.93 95.17,32.77 95.17,21.34 103.3,13.21 114.99,13.21 117.78,10.41 117.78,4.06 116.51,2.79 44.12,2.79 43.36,3.56 43.36,6.7 1J1.9
ST9  (via drill 0.3)
  Top 0.254: STM32.39 116.59,45.38 116.68,45.38 v116.76,45.47
  Bottom 0.254: 1J2.1 115.33,10.32 112.95,12.7 103.05,12.7 94.67,21.08 94.67,33.02 107.11,45.47 v116.76,45.47
ST10  (via drill 0.3)
  Top 0.254: STM32.40 116.09,45.88 116.16,45.88 v116.26,45.97
  Bottom 0.254: 1J2.2 111.37,10.22 109.65,11.94 103.05,11.94 94.16,20.83 94.16,33.27 106.86,45.97 v116.26,45.97
ST11  (via drill 0.3)
  Top 0.254: STM32.41 115.59,46.38 115.65,46.38 v115.75,46.48
  Bottom 0.254: 1J2.4 103.45,10.77 93.65,20.57 93.65,33.53 106.6,46.48 v115.75,46.48
ST12  (via drill 0.3)
  Top 0.254: STM32.42 115.09,46.63 115.13,46.88 v115.24,46.99
  Bottom 0.254: 1J2.5 99.49,13.97 93.14,20.32 93.14,33.78 106.35,46.99 v115.24,46.99
ST13  (via drill 0.3)
  Top 0.254: STM32.43 114.59,47.13 114.62,47.38 v114.73,47.5
  Bottom 0.254: 1J2.6 95.53,17.17 92.63,20.07 92.63,34.04 106.1,47.5 v114.73,47.5
ST14  (via drill 0.3)
  Top 0.254: STM32.44 114.09,47.88 v114.22,48.01
  Bottom 0.254: 1J2.7 91.57,16.97 92.13,17.53 92.13,34.29 105.84,48.01 v114.22,48.01
ST15  (via drill 0.3)
  Top 0.254: STM32.45 113.59,48.39 v113.72,48.51
  Bottom 0.254: 1J2.8 87.61,14.03 91.62,18.29 91.62,34.54 105.59,48.51 v113.72,48.51
ST16  (via drill 0.3)
  Top 0.254: STM32.46 113.09,48.91 v113.21,49.02
  Bottom 0.254: v113.21,49.02 105.33,49.02 91.11,34.8 91.11,18.8 83.74,11.43 83.74,6.95 1J2.9
VBAT  (via drill 0.3)
  Top 0.254: 144.04,32.45 C1.+ | C1.+ 143.88,32.33 141.91,34.29 v141.66,34.29 | STM32.6 128.32,32.64 v128.7,33.02 | R2.1 146.67,32.95 145.97,32.26 143.98,32.26 C1.+
  Bottom 0.254: v141.66,34.29 140.13,34.29 138.61,32.77 128.96,32.77 v128.7,33.02
VCAP1
  Top 0.254: STM32.49 111.59,48.56 C3.1
VCAP2
  Top 0.254: STM32.73 100.81,31.14 C4.1
VDDA
  Top 0.254: STM32.22 126.87,40.64
  Top 0.305: 126.87,40.64 127.64,41.41 127.64,43.83 C16.1 | R8.2 134.77,50.67 137.79,50.67 L1.2
  Top 0.406: C16.1 132.12,45.2 134,47.08 134.77,47.08 R8.2 | 134.77,50.67 134.68,50.67 C15.1
VREF
  Top 0.254: STM32.21 127.14,40.14 C14.1 131.86,42.56 R8.1
  Top 0.406: R8.1 136.32,45.47 136.83,44.96 138.5,44.96 C13.1

### Text on the board
tNames: + | 1 | + | GND | +5V | SYSXDMD REV 0.1 / (C) 2022 WWW.PIN2DMD.COM | + | + | DIO | GND | CLK | +3V3 | 1 | 1 | 9 | 1 | 9 | 1 | 12 | 26